# EasyEDA schematic EasyEDA-Schematic.json
TITLE: USB password manager; REV: 1.0; Date: 2019-02-14; Sheet: 1/1; Drawn By: Julian Schuler
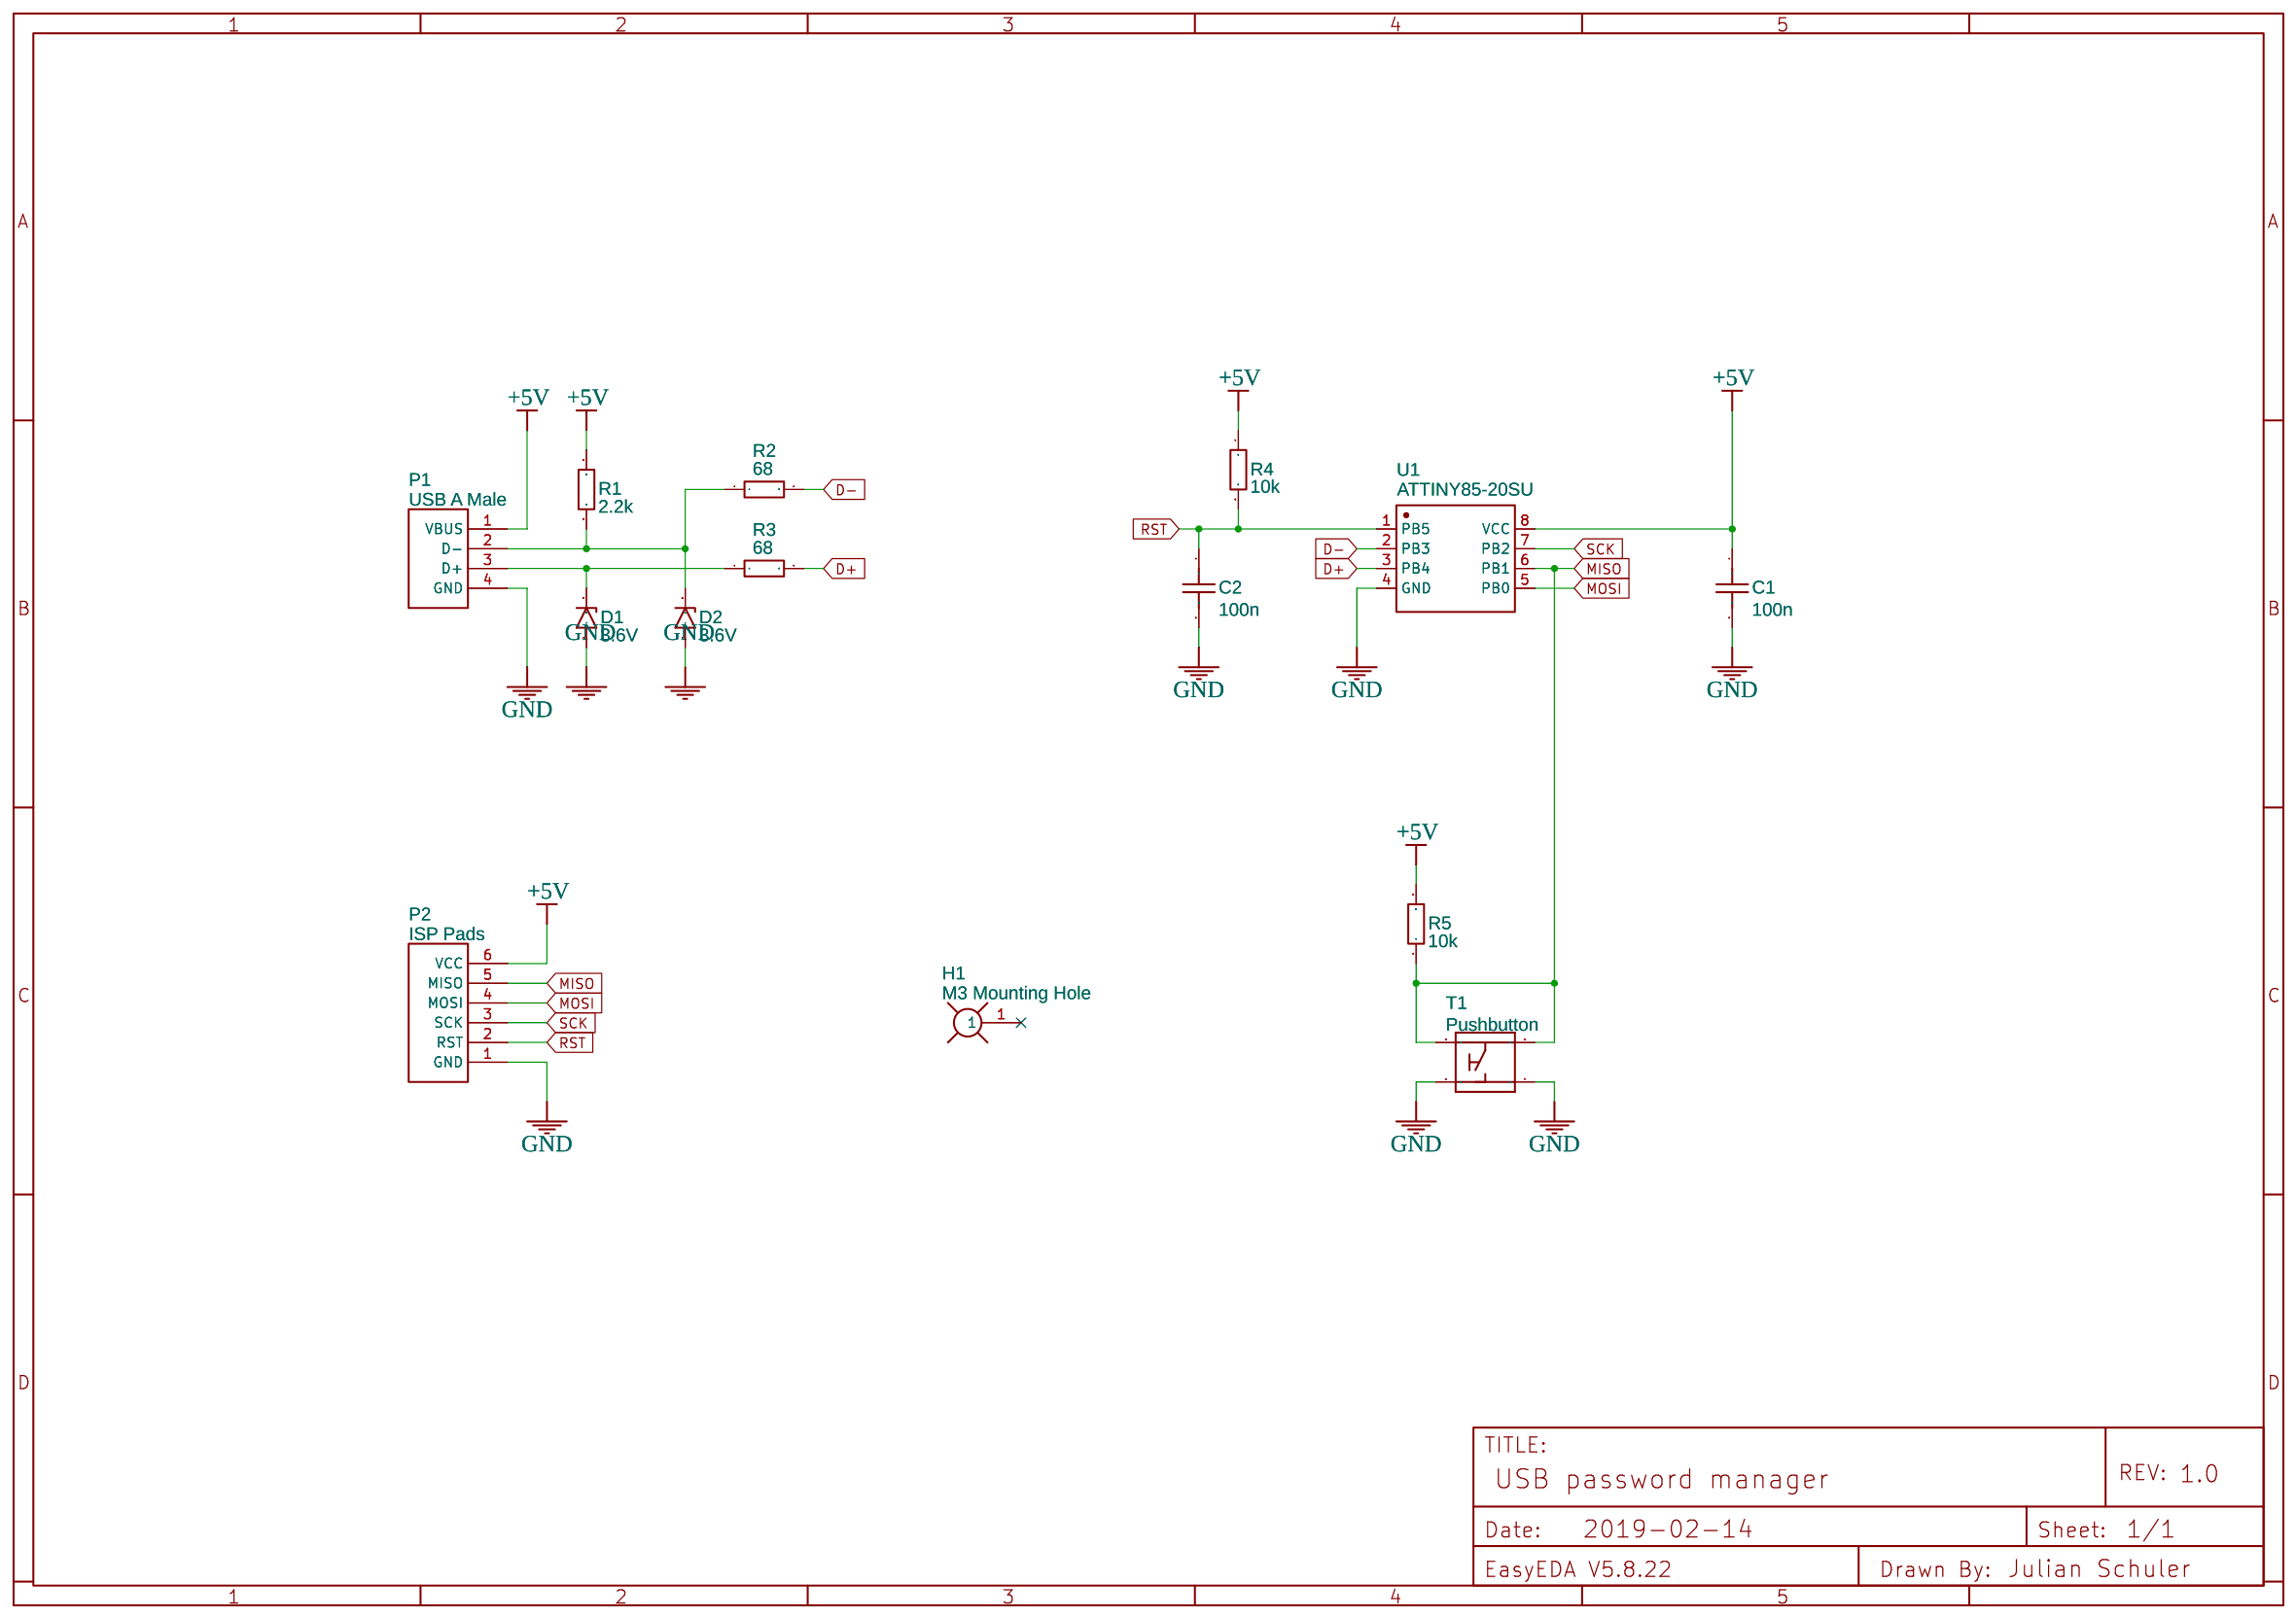
[diagram p0: schematic sheet]

## Parts
C1  100n  [0603]
C2  100n  [0603]
D1  3.6V  [LL-34]
D2  3.6V  [LL-34]
H1  M3 Mounting Hole  [M3 HOLE]
P1  USB A Male  [USB A MALE]
P2  ISP Pads  [ISP PADS]
R1  2.2k  [0603]
R2  68  [0603]
R3  68  [0603]
R4  10k  [0603]
R5  10k  [0603]
T1  Pushbutton  [SWITCH BUTTON TACT 6.2X6.2 SMD]
U1  ATTINY85-20SU  [SOIC-8_208MIL]

## Library data of the parts
C1 C2 = Cap_0603_US: Manufacturer Part: ?
D1 D2 P1 = -: Contributor: Julian42; Manufacturer Part: ?
H1 = -: Manufacturer Part: ?; Contributor: Julian42
P2 = -: Contributor: Julian42
R1-R5 = Res_0603(1/10W)_EU: Manufacturer Part: ?
T1 = -: SWITCH TACTILE SPST-NO 0.05A 12V; catid: 20; Manufacturer Part: TS-1109
U1 = -: Supplier: LCSC; Manufacturer: MICROCHIP; Supplier Part: C89852

## Nets
+5V: C1.1 P1.1(VBUS) P2.6(VCC) R1.2 R4.1 R5.2 U1.8(VCC)
GND: C1.2 C2.2 D1.A D2.A P1.4(GND) P2.1(GND) T1.3(B0) T1.4(B1) U1.4(GND)
D+: R3.2 U1.3(PB4)
D-: R2.2 U1.2(PB3)
MISO: P2.5(MISO) R5.1 T1.1(A1) T1.2(A0) U1.6(PB1)
MOSI: P2.4(MOSI) U1.5(PB0)
RST: C2.1 P2.2(RST) R4.2 U1.1(PB5)
SCK: P2.3(SCK) U1.7(PB2)
D1_C: D1.C P1.3(D+) R3.1
R1_1: D2.C P1.2(D-) R1.1 R2.1

Not connected (* = marked no-connect by the designer): H1 1*
